# EasyEDA Pro project Stage2_2026-08-26.epro

# Board PCB1
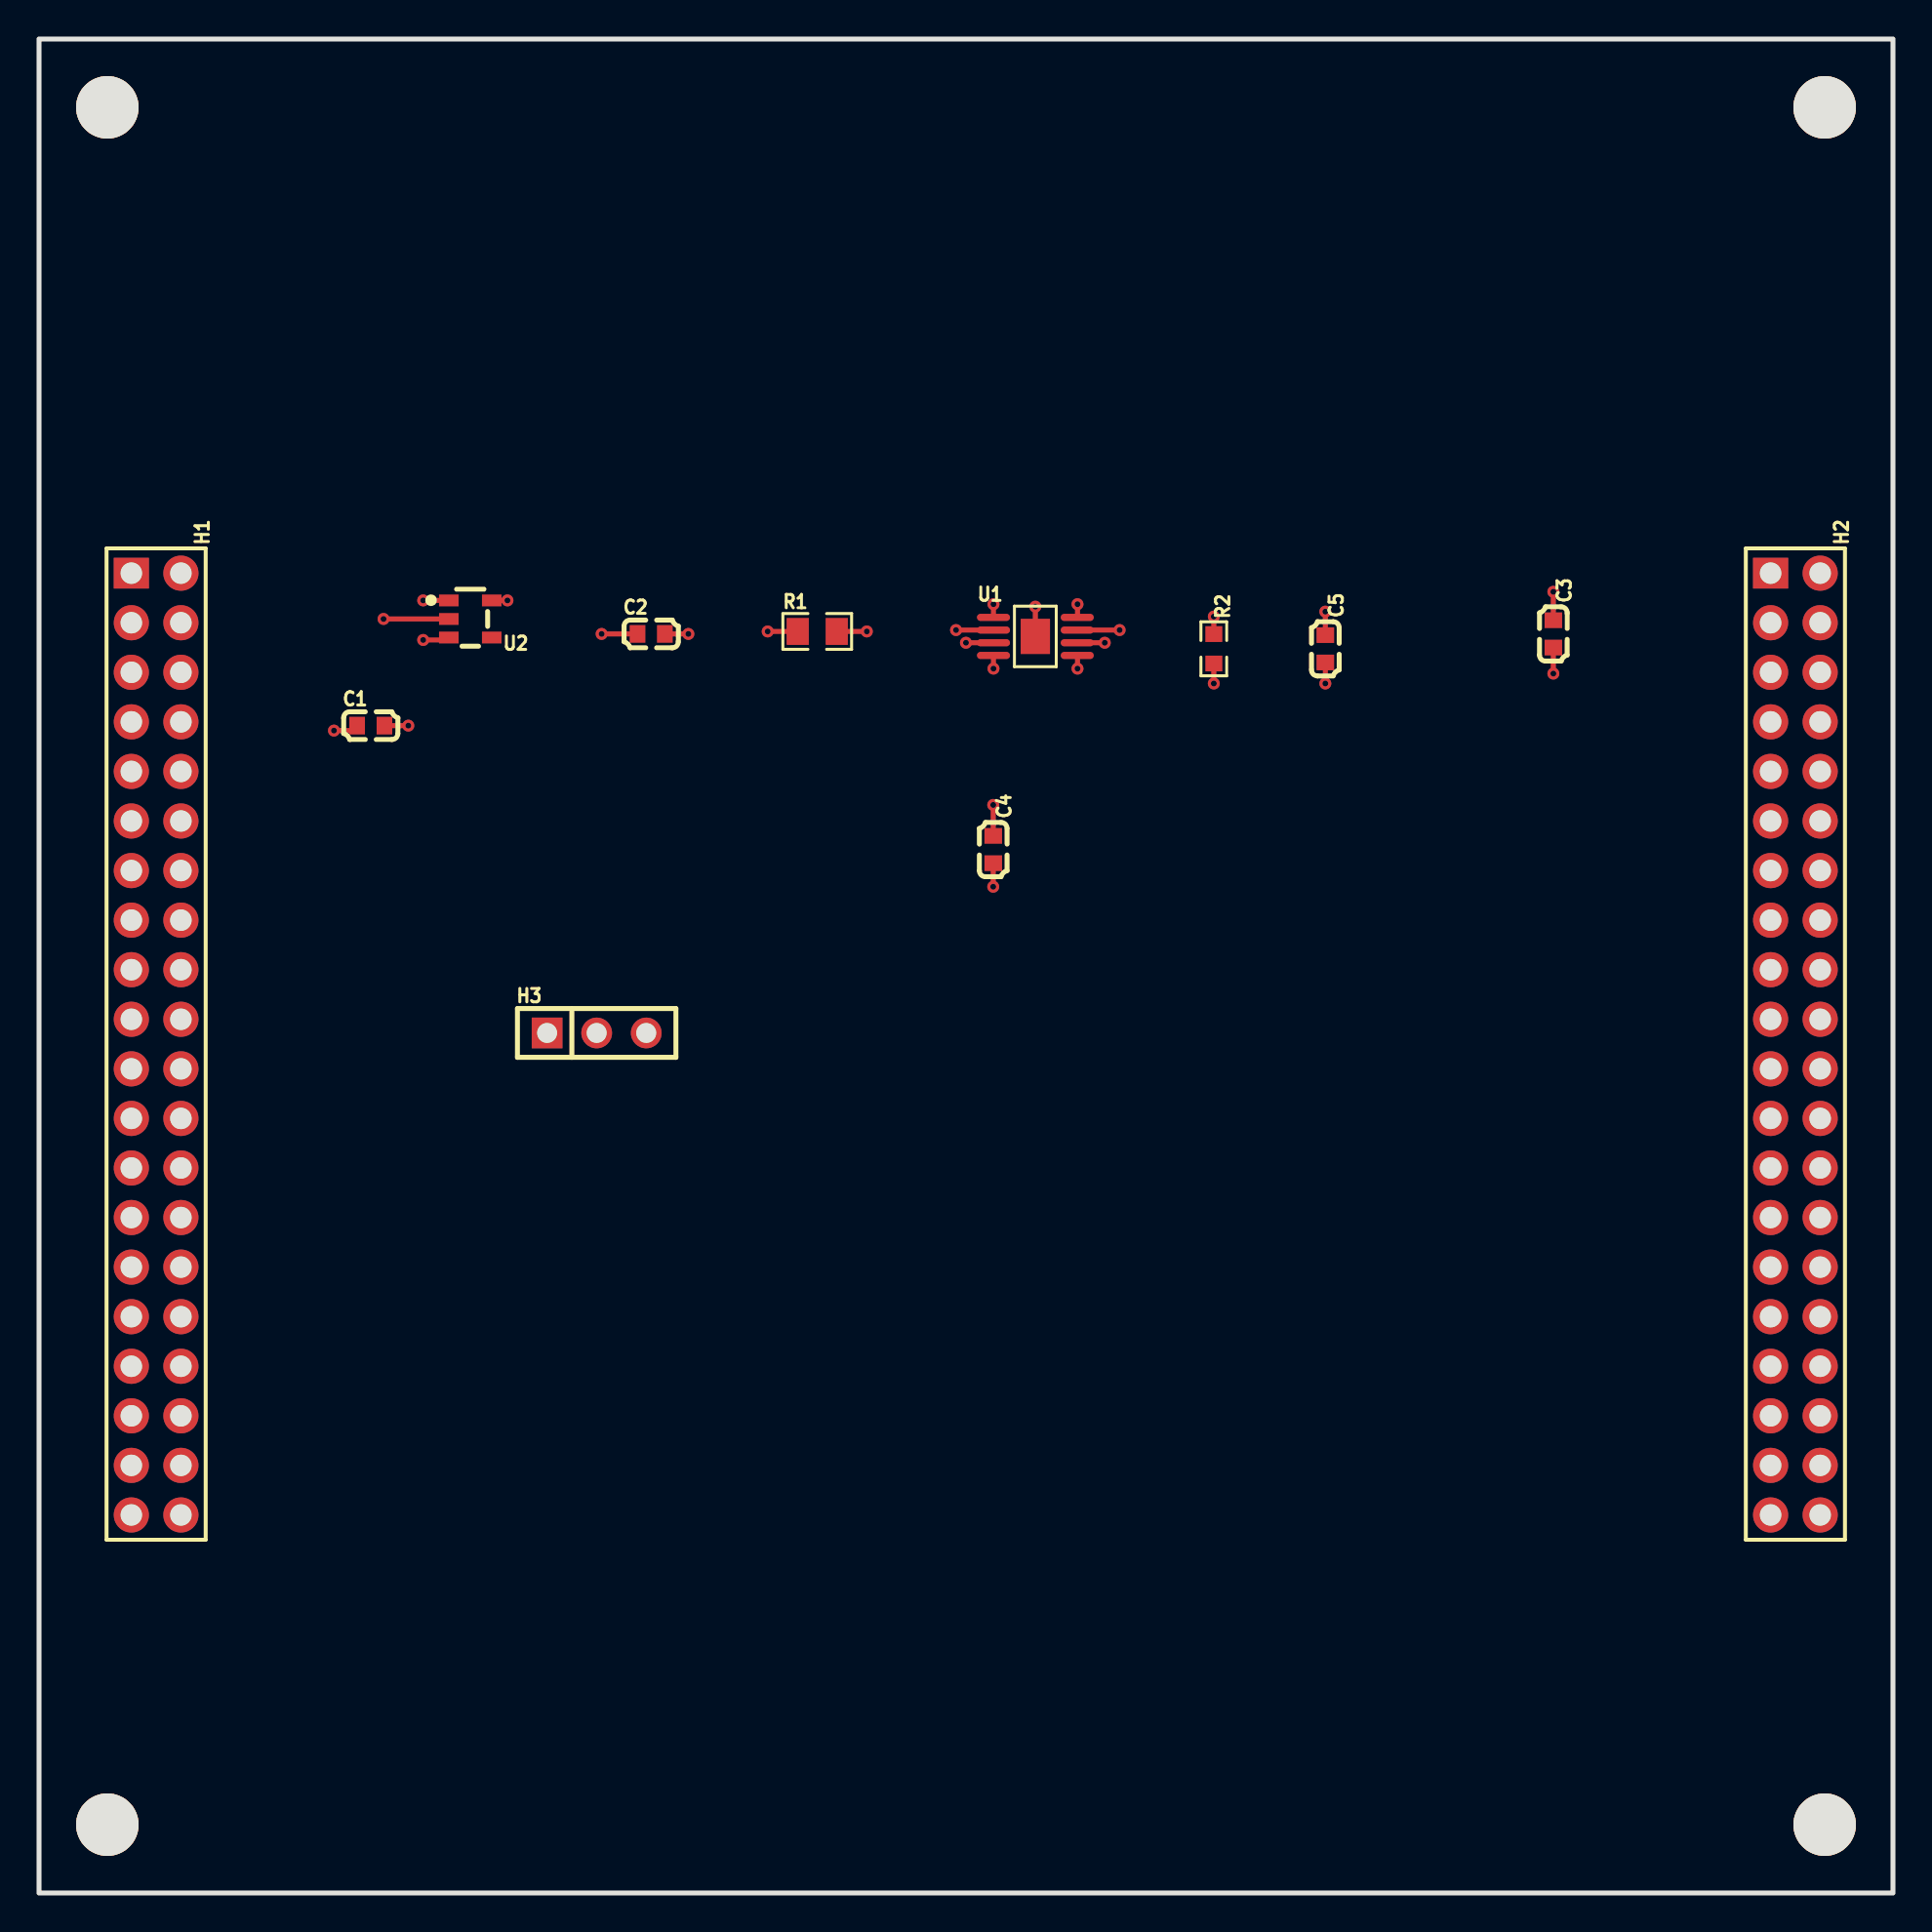
[diagram p0: board, top side]
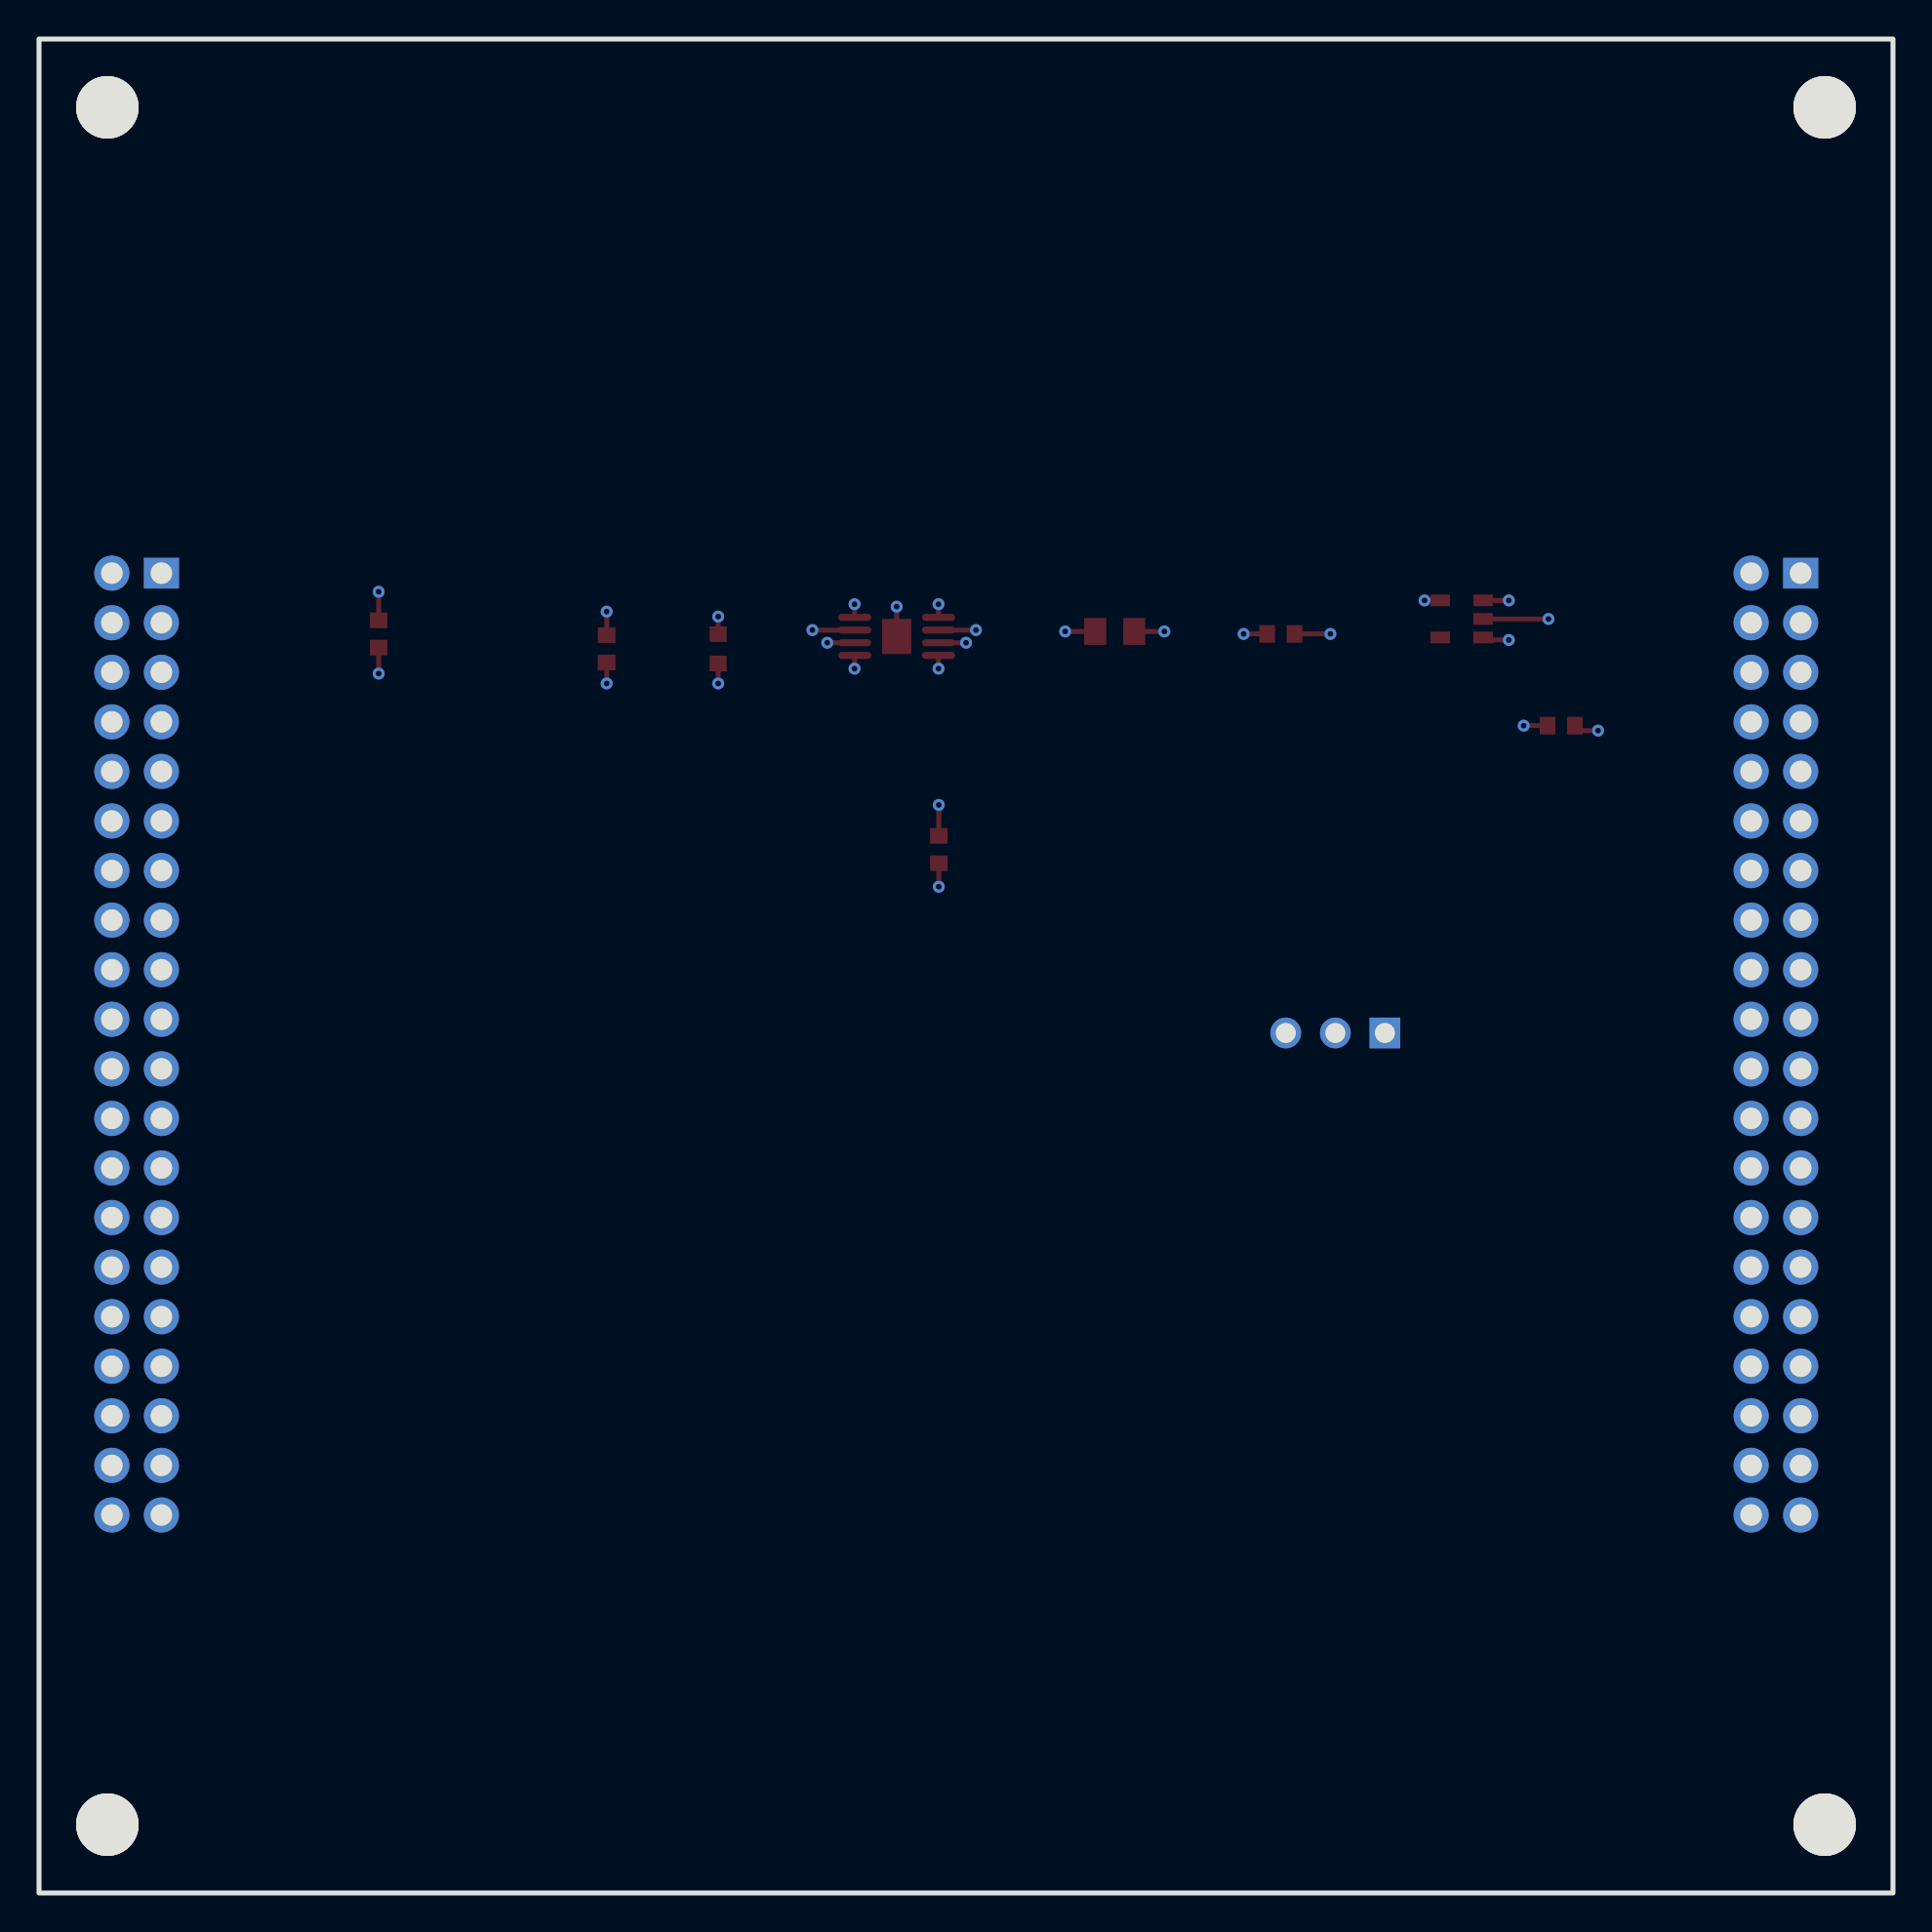
[diagram p1: board, bottom side, seen from below]

Outline 95 x 95 mm; copper layers: Top Layer, Inner1, Inner2, Bottom Layer. Coordinates in mm from the lower left corner of the outline.
Outline path: rectangle 0,95 95,0
Stack: Top Layer 0.035mm Outer layer thickness 1oz / Dielectric1 0.2104mm 7628 RC49% 8.6mil / Inner1 0.0152mm Inner layer thickness / Dielectric2 1.065mm 1.1mm H/HOZ Copper / Inner2 0.0152mm Inner layer thickness / Dielectric3 0.2104mm 7628 RC49% 8.6mil / Bottom Layer 0.035mm Outer layer thickness 1oz

## Design rules (mm)
spacing copperThickness1oz (default): track to track 0.102, other pairs 0.152 to 0.3
spacing copperThickness2oz: track to track 0.203, other pairs 0.152 to 0.3
track width copperThickness1oz (default): min 0.127, default 0.254, max 2.54
track width copperThickness2oz: min 0.203, default 0.254, max 2.54
differential pair differentialPair (default): width min 0.127, default 0.254, max 2.54; gap min 0.152, default 0.152
net GND uses copperRegion

## Placement (name value [footprint] x y rotation side)
C1  10uF  [C0603]  17 59.82 0 top
C2  10uF  [C0603]  31.37 64.52 0 top
C3  100nF  [C0603]  77.6 64.52 270 top
C4  100nF  [C0603]  48.9 53.47 270 top
C5  10pF  [C0603]  65.91 63.75 270 top
H1  2.54mm 2*20P直排针  [HDR-TH_40P-P2.54-V-M-R2-C20-S2.54]  6 43.5 270 top
H2  2.54mm 2*20P直排针  [HDR-TH_40P-P2.54-V-M-R2-C20-S2.54]  90 43.5 270 top
H3  PM254V-11-03-H85  [HDR-TH_3P-P2.54-V-F]  28.57 44.07 0 top
NOREF  -  [Pad_e10]  91.5 91.5 0 top
NOREF#2  -  [Pad_e12]  3.5 91.5 0 top
NOREF#3  -  [Pad_e13]  3.5 3.5 0 top
NOREF#4  -  [Pad_e11]  91.5 3.5 0 top
R1  10kΩ  [R0805]  39.88 64.64 0 top
R2  1kΩ  [R0603]  60.2 63.75 270 top
U1  LTC6227HMS8E#PBF  [MSOP-8_L3.0-W3.0-P0.65-LS4.9-TL-EP]  51.05 64.39 0 top
U2  TPS7A2433DBVR  [SOT-23-5_L2.9-W1.6-P0.95-LS2.8-BR]  22.1 65.28 180 top

## Footprints (pads in the part's own frame, mm; a bottom-side part is the same pattern mirrored in y, then rotated)
C0603
  rect 0.8x0.9 smd: 1(-0.7,0) 2(0.7,0)
HDR-TH_3P-P2.54-V-F
  rect 1.575x1.575 hole 1.02: 1(-2.54,0)
  round 1.575 hole 1.02: 2(0,0) 3(2.54,0)
HDR-TH_40P-P2.54-V-M-R2-C20-S2.54
  rect 1.575x1.8 hole 1.1: 1(-24.13,-1.27)
  round 1.8 hole 1.1: 2(-24.13,1.27) 3(-21.59,-1.27) 4(-21.59,1.27) 5(-19.05,-1.27) 6(-19.05,1.27) 7(-16.51,-1.27) 8(-16.51,1.27) 9(-13.97,-1.27) 10(-13.97,1.27) 11(-11.43,-1.27) 12(-11.43,1.27) 13(-8.89,-1.27) 14(-8.89,1.27) 15(-6.35,-1.27) 16(-6.35,1.27) 17(-3.81,-1.27) 18(-3.81,1.27) 19(-1.27,-1.27) 20(-1.27,1.27) 21(1.27,-1.27) 22(1.27,1.27) 23(3.81,-1.27) 24(3.81,1.27) 25(6.35,-1.27) 26(6.35,1.27) 27(8.89,-1.27) 28(8.89,1.27) 29(11.43,-1.27) 30(11.43,1.27) 31(13.97,-1.27) 32(13.97,1.27) 33(16.51,-1.27) 34(16.51,1.27) 35(19.05,-1.27) 36(19.05,1.27) 37(21.59,-1.27) 38(21.59,1.27) 39(24.13,-1.27) 40(24.13,1.27)
MSOP-8_L3.0-W3.0-P0.65-LS4.9-TL-EP
  oval 1.692x0.364 smd: 1(-2.146,0.975) 2(-2.146,0.325) 3(-2.146,-0.325) 4(-2.146,-0.975) 5(2.146,-0.975) 6(2.146,-0.325) 7(2.146,0.325) 8(2.146,0.975)
  rect 1.5x1.8 smd: 9(0,0)
Pad_e10
  round 3.2 hole 3.2: 1(0,0)
Pad_e11
  round 3.2 hole 3.2: 1(0,0)
Pad_e12
  round 3.2 hole 3.2: 1(0,0)
Pad_e13
  round 3.2 hole 3.2: 1(0,0)
R0603
  rect 0.806x0.864 smd: 1(-0.753,0) 2(0.753,0)
R0805
  rect 1.133x1.377 smd: 1(-1,0) 2(1,0)
SOT-23-5_L2.9-W1.6-P0.95-LS2.8-BR
  rect 1x0.6 smd: 1(1.1,-0.95) 2(1.1,0) 3(1.1,0.95) 4(-1.1,0.95) 5(-1.1,-0.95)

## Nets
3V3: C2.1 C3.1 H3.2 U1.8 U2.5
+3V3_SYS: C1.1 H1.4 U2.1 U2.3
GND: C1.2 C2.2 C3.2 C4.2 H1.1 H1.2 H3.3 R1.2 U1.5 U1.9 U2.2
FILTER1: C5.1 R2.1 U1.6
PULSE_OUT: H3.1 R1.1 U1.1 U1.2
SHAPING: C5.2 R2.2 U1.3 U1.7
V-: C4.1 U1.4

Pads without a net: H1 3 5 6 7 8 9 10 11 12 13 14 15 16 17 18 19 20 21 22 23 24 25 26 27 28 29 30 31 32 33 34 35 36 37 38 39 40; H2 1 2 3 4 5 6 7 8 9 10 11 12 13 14 15 16 17 18 19 20 21 22 23 24 25 26 27 28 29 30 31 32 33 34 35 36 37 38 39 40; NOREF 1; NOREF#2 1; NOREF#3 1; NOREF#4 1; U2 4

## Via types
v1: diameter 0.61, hole 0.305, Top Layer to Bottom Layer, 27 vias

## Routing (per net, layer and track width the routed paths; a pad name or vN(x,y) marks a point on that pad's centre or on a via; arc(x,y) is an arc through that point)
3V3: length 82.3
  Top Layer w0.254: v1(53.21,66.04) 53.21,65.38 U1.8 ; C2.1 v1(28.83,64.52) ; C3.1 v1(77.6,66.67) ; U2.5 v1(24,66.23)
  Inner2 w0.254: v1(28.83,64.52) 32,67.69 51.56,67.69 v1(53.21,66.04) 54.36,67.18 77.09,67.18 v1(77.6,66.67) ; v1(28.83,64.52) 28.83,44.32 H3.2 ; v1(28.83,64.52) 26.99,64.52 25.27,66.23 v1(24,66.23)
+3V3_SYS: length 22.7
  Top Layer w0.254: U2.3 20.87,64.21 v1(19.69,64.21) ; 16.3,59.82 16.05,59.56 v1(15.11,59.56) ; U2.1 v1(19.69,66.23)
  Inner2 w0.254: v1(19.69,66.23) v1(19.69,64.21) 15.11,59.63 v1(15.11,59.56) 14.48,59.56 8.95,65.09 H1.4
GND: length 12.1
  Top Layer w0.254: C2.2 v1(33.27,64.52) ; C4.2 v1(48.9,51.56) ; U2.2 v1(17.65,65.28) ; R1.2 v1(42.42,64.64) ; C3.2 v1(77.6,62.48) ; U1.9 v1(51.05,65.91) ; U1.5 53.21,63.4 v1(53.21,62.74) ; C1.2 v1(18.92,59.82)
FILTER1: length 15.7
  Top Layer w0.254: C5.1 v1(65.91,65.66) ; U1.6 v1(54.61,64.06) ; R2.1 v1(60.2,65.41)
  Inner2 w0.254: v1(54.61,64.06) 59.24,64.06 60.2,65.02 v1(60.2,65.41) 65.66,65.41 v1(65.91,65.66)
PULSE_OUT: length 51.6
  Top Layer w0.254: U1.2 v1(46.99,64.71) ; U1.1 v1(48.91,66.04) ; R1.1 v1(37.34,64.64)
  Inner2 w0.254: v1(48.91,66.04) 48.32,66.04 v1(46.99,64.71) 45.01,62.74 40.64,62.74 38.74,64.64 v1(37.34,64.64) 37.34,45.08 33.4,41.15 28.96,41.15 26.03,44.07
SHAPING: length 30.8
  Top Layer w0.254: U1.3 v1(47.5,64.06) ; R2.2 v1(60.2,61.98) ; C5.2 v1(65.91,61.98) ; U1.7 v1(55.37,64.71)
  Inner2 w0.254: v1(65.91,61.98) v1(60.2,61.98) 51.94,61.98 49.85,64.06 ; 49.85,64.06 50.5,64.71 v1(55.37,64.71) ; 49.85,64.06 v1(47.5,64.06)
V-: length 9.3
  Top Layer w0.254: C4.1 v1(48.9,55.75) ; U1.4 v1(48.91,62.74)
  Inner2 w0.254: v1(48.91,62.74) 48.91,55.77 v1(48.9,55.75)

## Copper pours and planes (outline as drawn; the poured copper is in the pictures)
GND on Inner1: 0,95 95,95 95,0 0,0
